# Altium schematic sheet SheetConnection.SchDoc
size A4
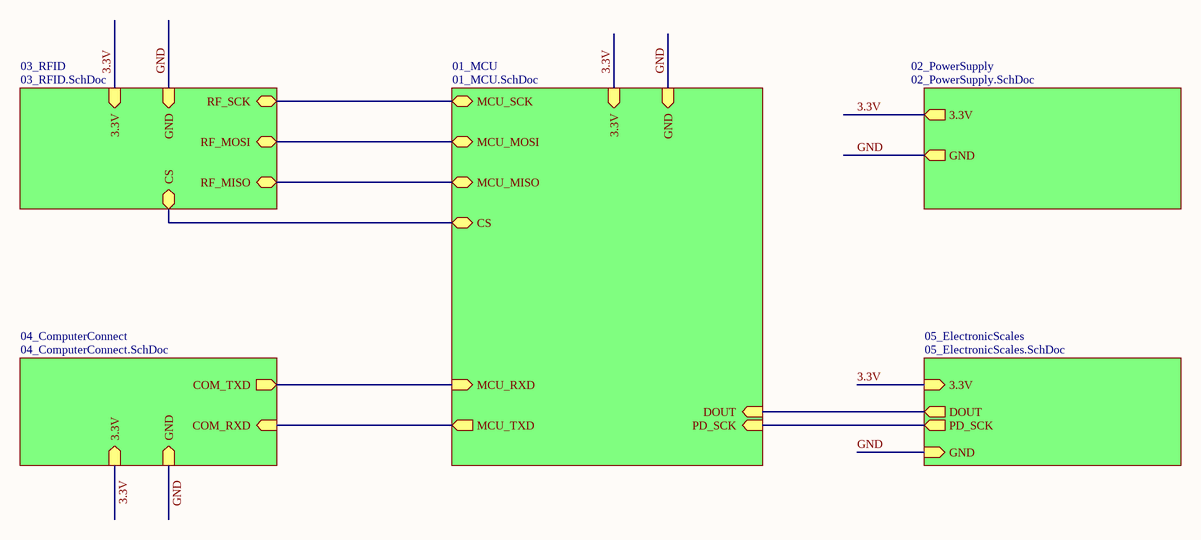
[diagram p0: SheetConnection.SchDoc]

## Sub-sheets
01_MCU = 01_MCU.SchDoc: MCU_TXD (out), MCU_RXD (in), MCU_SCK (bidir), MCU_MOSI (bidir), MCU_MISO (bidir), GND (in), 3.3V (in), CS (bidir), DOUT (in), PD_SCK (in)
02_PowerSupply = 02_PowerSupply.SchDoc: 3.3V (out), GND (out)
03_RFID = 03_RFID.SchDoc: RF_SCK (bidir), RF_MOSI (bidir), RF_MISO (bidir), GND (in), 3.3V (in), CS (bidir)
04_ComputerConnect = 04_ComputerConnect.SchDoc: COM_TXD (out), COM_RXD (in), GND (in), 3.3V (in)
05_ElectronicScales = 05_ElectronicScales.SchDoc: 3.3V (in), GND (in), DOUT (out), PD_SCK (out)

## Nets
3.3V: sheet 01_MCU/3.3V, sheet 05_ElectronicScales/3.3V, sheet 03_RFID/3.3V, sheet 04_ComputerConnect/3.3V, sheet 02_PowerSupply/3.3V
GND: sheet 01_MCU/GND, sheet 05_ElectronicScales/GND, sheet 03_RFID/GND, sheet 04_ComputerConnect/GND, sheet 02_PowerSupply/GND
(unnamed): sheet 01_MCU/MCU_TXD, sheet 04_ComputerConnect/COM_RXD
(unnamed): sheet 01_MCU/MCU_RXD, sheet 04_ComputerConnect/COM_TXD
(unnamed): sheet 01_MCU/MCU_SCK, sheet 03_RFID/RF_SCK
(unnamed): sheet 01_MCU/MCU_MOSI, sheet 03_RFID/RF_MOSI
(unnamed): sheet 01_MCU/MCU_MISO, sheet 03_RFID/RF_MISO
(unnamed): sheet 01_MCU/CS, sheet 03_RFID/CS
(unnamed): sheet 01_MCU/DOUT, sheet 05_ElectronicScales/DOUT
(unnamed): sheet 01_MCU/PD_SCK, sheet 05_ElectronicScales/PD_SCK

## Notes on the sheet
- Project:
- MANDevices
- Page Contents:
- Size:
- Date:
- A4
- Checked by:
- Time:
- Revision:
- Sheet
- of
- HaNoi University of
- Science and Technology
- File: